# Altium schematic sheet MCU V3.1.SchDoc
size 410 x 182 mm
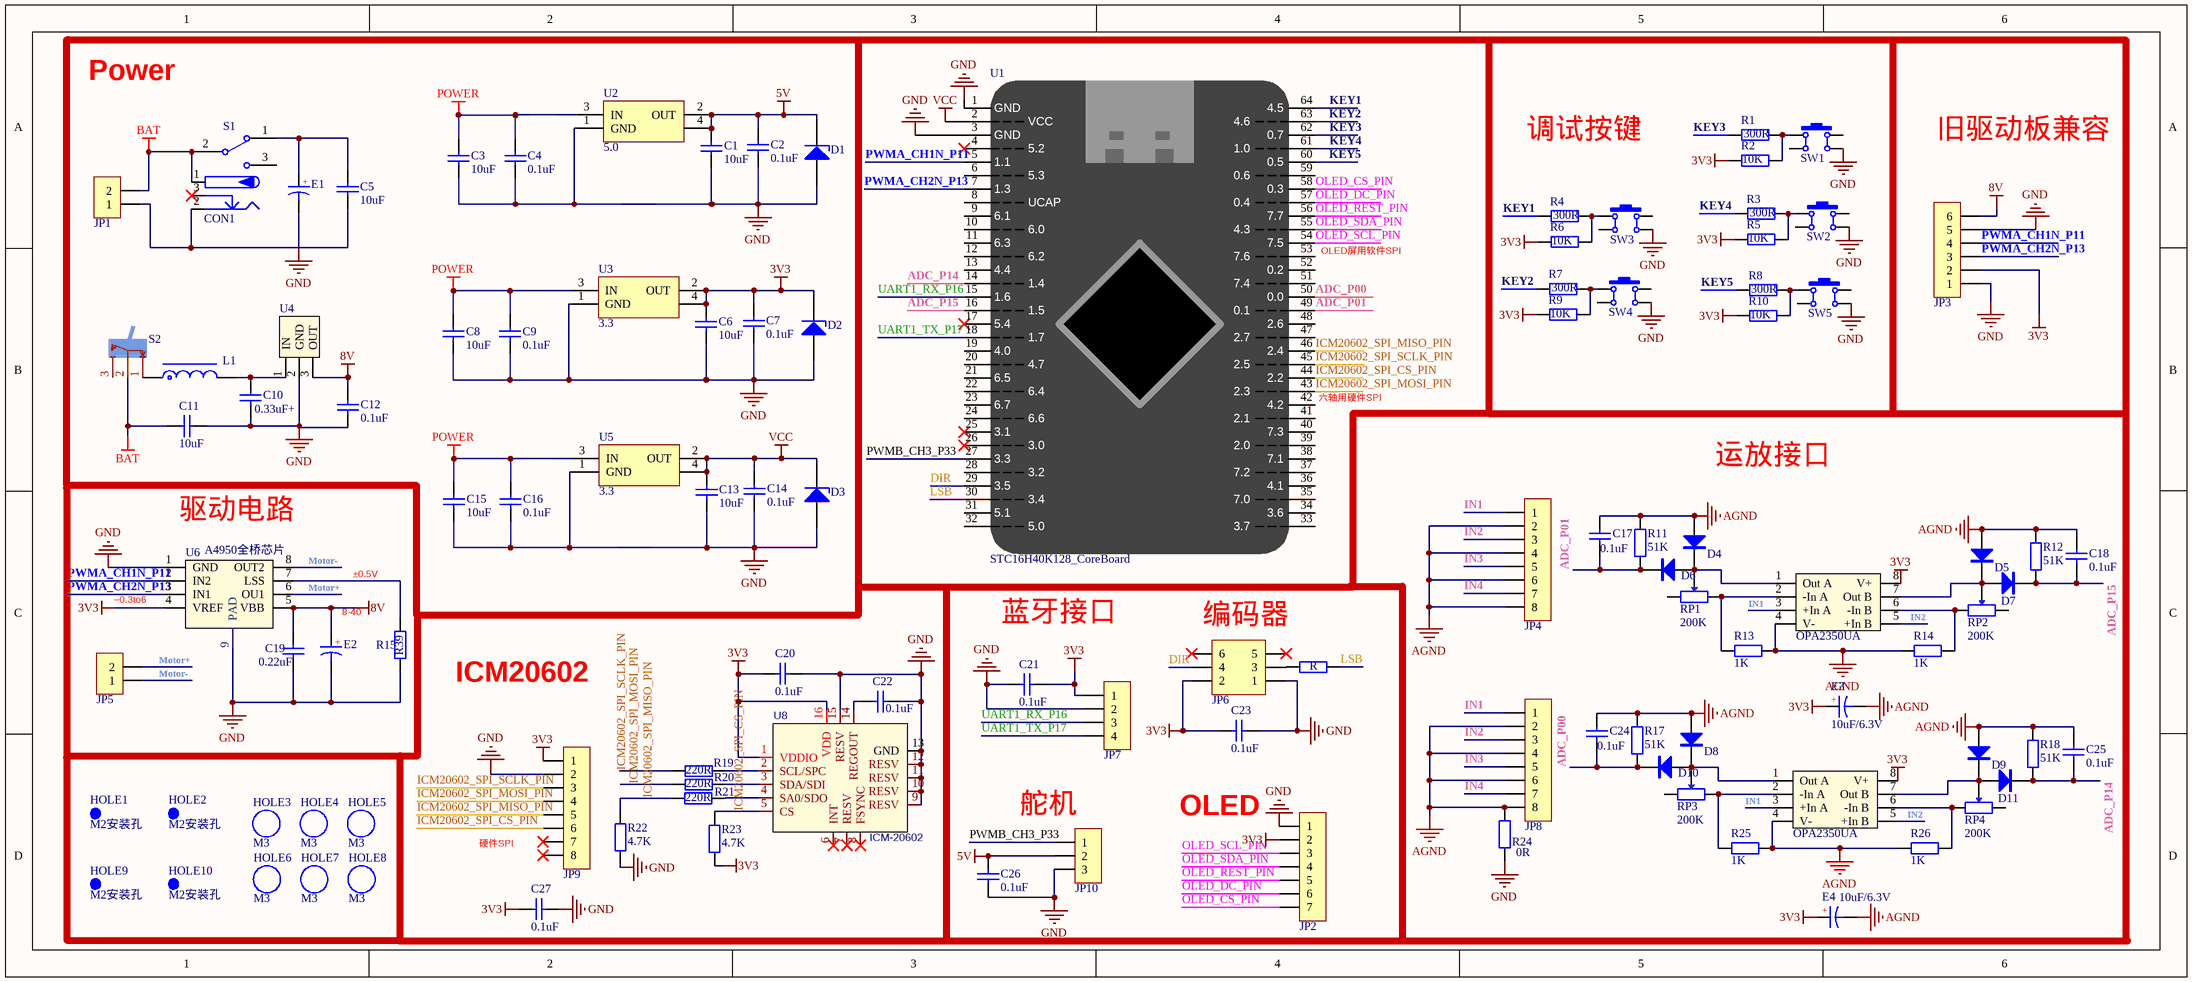
[diagram p0: MCU V3.1.SchDoc]

## Parts
C1  10uF  [C0805_M]
C2  0.1uF  [C0603_M]
C3  10uF  [C0805_M]
C4  0.1uF  [C0603_M]
C5  10uF  [C0805_M]
C6  10uF  [C0805_M]
C7  0.1uF  [C0603_M]
C8  10uF  [C0805_M]
C9  0.1uF  [C0603_M]
C10  0.33uF+  [C0603_M]
C11  10uF  [C0805_M]
C12  0.1uF  [C0603_M]
C13  10uF  [C0805_M]
C14  0.1uF  [C0603_M]
C15  10uF  [C0805_M]
C16  0.1uF  [C0603_M]
C17  0.1uF  [C0603_M]
C18  0.1uF  [C0603_M]
C19  0.22uF  [C0603_M]
C20  0.1uF  [C0603_M]
C21  0.1uF  [C0603_M]
C22  0.1uF  [C0603_M]
C23  0.1uF  [C0603_M]
C24  0.1uF  [C0603_M]
C25  0.1uF  [C0603_M]
C26  0.1uF  [C0603_M]
C27  0.1uF  [C0603_M]
CON1  3.5*1.3  [DC-005]  (value not drawn)
D1  稳压二极管  [稳压二极管 LL-34_L3.5-W1.5-RD]  (value not drawn)
D2  稳压二极管  [稳压二极管 LL-34_L3.5-W1.5-RD]  (value not drawn)
D3  稳压二极管  [稳压二极管 LL-34_L3.5-W1.5-RD]  (value not drawn)
D4  1N5819W  [SOD-123]  (value not drawn)
D5  1N5819W  [SOD-123]  (value not drawn)
D6  1N5819W  [SOD-123]  (value not drawn)
D7  1N5819W  [SOD-123]  (value not drawn)
D8  1N5819W  [SOD-123]  (value not drawn)
D9  1N5819W  [SOD-123]  (value not drawn)
D10  1N5819W  [SOD-123]  (value not drawn)
D11  1N5819W  [SOD-123]  (value not drawn)
E1  100uF/16V  [CT 2.0*5*8 - R]  (value not drawn)
E2  100uF/16V  [CS 6*6 - B]  (value not drawn)
E3  10uF/6.3V  [C_3216]
E4  10uF/6.3V  [C_3216]
HOLE1  M2安装孔  [M2安装孔]
HOLE2  M2安装孔  [M2安装孔]
HOLE3  M3  [M3 125X200]
HOLE4  M3  [M3 125X200]
HOLE5  M3  [M3 125X200]
HOLE6  M3  [M3 125X200]
HOLE7  M3  [M3 125X200]
HOLE8  M3  [M3 125X200]
HOLE9  M2安装孔  [M2安装孔]
HOLE10  M2安装孔  [M2安装孔]
JP1  HDR-1X2  [XH2.54-LI-2P]  (value not drawn)
JP2  HDR-1X7  [HDR2.54-M-LI-7P]  (value not drawn)
JP3  HDR-1X6  [XH2.54-LI-6P]  (value not drawn)
JP4  FPC1.0-8P  [FPC0.5 2H-WS-8P]  (value not drawn)
JP5  HDR-1X2  [XH2.54-LI-2P]  (value not drawn)
JP6  Header3X2  [IDC2.54-LI-2x3P]  (value not drawn)
JP7  HDR-1X4  [HDR2.54-M-LI-4P]  (value not drawn)
JP8  ICM-20602  [HDR2.54-LI-8P]  (value not drawn)
JP9  ICM-20602  [HDR2.54-8P]  (value not drawn)
JP10  HDR-1X3  [HDR2.54-LI-3P]  (value not drawn)
L1  10uH  [CDRH74]  (value not drawn)
R1  300R  [R0603_M]
R2  10K  [R0603_M]
R3  300R  [R0603_M]
R4  300R  [R0603_M]
R5  10K  [R0603_M]
R6  10K  [R0603_M]
R7  300R  [R0603_M]
R8  300R  [R0603_M]
R9  10K  [R0603_M]
R10  10K  [R0603_M]
R11  51K  [R0805_L]
R12  51K  [R0805_L]
R13  1K  [R0805_L]
R14  1K  [R0805_L]
R15  R39  [R0603_M]
R16  R  [R0603_M]
R17  51K  [R0805_L]
R18  51K  [R0805_L]
R19  220R  [R0603_M]
R20  220R  [R0603_M]
R21  220R  [R0603_M]
R22  4.7K  [R0603_M]
R23  4.7K  [R0603_M]
R24  0R  [R0805_M]
R25  1K  [R0805_L]
R26  1K  [R0805_L]
RP1  200K  [3266Y]
RP2  200K  [3266Y]
RP3  200K  [3266Y]
RP4  200K  [3266Y]
S1  SS-12F23  [拨动开关 大电流 SS-12D10]  (value not drawn)
S2  3脚2档小摇臂开关  [3脚3档小摇臂开关]  (value not drawn)
SW1  P5.0  [SW-SMD_4P-L4.2-W3.3-P2.15-LS5.1]  (value not drawn)
SW2  P5.0  [SW-SMD_4P-L4.2-W3.3-P2.15-LS5.1]  (value not drawn)
SW3  P5.0  [SW-SMD_4P-L4.2-W3.3-P2.15-LS5.1]  (value not drawn)
SW4  P5.0  [SW-SMD_4P-L4.2-W3.3-P2.15-LS5.1]  (value not drawn)
SW5  P5.0  [SW-SMD_4P-L4.2-W3.3-P2.15-LS5.1]  (value not drawn)
U1  STC16H40K128_CoreBoard  [STC16H40K128_CoreBoard]
U2  5.0  [SOT223]
U3  3.3  [SOT223]
U4  8V稳压输出-1.5A  [TO220B]  (value not drawn)
U5  3.3  [SOT223]
U6  A4950全桥芯片  [SOIC-8_EP]
U7  OPA2350UA  [SOIC-8_150mil]
U8  ICM-20602  [LGA-16_L3.0-W3.0-P0.50-BL]
U9  OPA2350UA  [SOIC-8_150mil]

## Blocks framed on the sheet
Power: C1-C16 CON1 D1-D3 E1 JP1 L1 S1 S2 U2-U5

## Nets
3V3: C6.2 C7.2 C20.2 C21.1 C23.2 C27.2 D2.2(K) E3.1(A) E4.1(A) JP2.2 JP3.2 JP6.2 JP7.1 JP9.1 R2.2 R5.2 R6.2 R9.2 R10.2 R23.2 U3.2(OUT) U3.4 U6.4(VREF) U7.8(V+) U8.1(VDDIO) U8.16(VDD) U9.8(V+)
5V: C1.2 C2.2 C26.1 D1.2(K) JP10.2 U2.2(OUT) U2.4
8V: C12.1 C19.1 E2.1 JP3.6 U4.3(OUT) U6.5(VBB)
AGND: C17.2 C18.2 C24.2 C25.2 D4.1(A) D5.1(A) D8.1(A) D9.1(A) E3.2(K) E4.2(K) JP4.2 JP4.4 JP4.6 JP4.8 JP8.2 JP8.4 JP8.6 JP8.8 R11.1 R12.1 R13.2 R14.2 R17.1 R18.1 R24.2 R25.2 R26.2 U7.4(V-) U9.4(V-)
BAT: C11.2 CON1.1 JP1.2 S1.2 S2.2
GND: C1.1 C2.1 C3.1 C4.1 C5.1 C6.1 C7.1 C8.1 C9.1 C10.2 C11.1 C12.2 C13.1 C14.1 C15.1 C16.1 C19.2 C20.1 C21.2 C22.2 C23.1 C26.2 C27.1 CON1.2 D1.1(A) D2.1(A) D3.1(A) E1.2 E2.2 JP1.1 JP2.1 JP3.1 JP3.5 JP6.1 JP7.2 JP9.2 JP10.3 R15.1 R22.2 R24.1 SW1.3 SW2.3 SW3.3 SW4.3 SW5.3 U1.1(GND) U1.3(GND) U2.1(GND) U3.1(GND) U4.2(GND) U5.1(GND) U6.1(GND) U6.9(PAD) U8.9(RESV) U8.10(RESV) U8.11(RESV) U8.12(RESV) U8.13(GND) U8.15(RESV)
POWER: C3.2 C4.2 C8.2 C9.2 C15.2 C16.2 U2.3(IN) U3.3(IN) U5.3(IN)
VCC: C13.2 C14.2 D3.2(K) U1.2(VCC) U5.2(OUT) U5.4
ADC_P00: C24.1 D10.2(K) R17.2 U1.50(0.0)
ADC_P01: C17.1 D6.2(K) R11.2 U1.49(0.1)
ADC_P14: C25.1 D11.2(K) R18.2 U1.14(1.4)
ADC_P15: C18.1 D7.2(K) R12.2 U1.16(1.5)
DIR: JP6.4 U1.29(3.5)
ICM20602_SPI_CS_PIN: JP9.6 R23.1 U1.44(2.2) U8.5(CS)
ICM20602_SPI_MISO_PIN: JP9.5 R21.2 R22.1 U1.46(2.4)
ICM20602_SPI_MOSI_PIN: JP9.4 R20.2 U1.43(2.3)
ICM20602_SPI_SCLK_PIN: JP9.3 R19.2 U1.45(2.5)
IN1: JP4.1 JP8.1 U7.3(+In_A) U9.3(+In_A)
IN2: JP4.3 JP8.3 U7.5(+In_B) U9.5(+In_B)
IN3: JP4.5 JP8.5
IN4: JP4.7 JP8.7
KEY1: R4.1 U1.64(4.5)
KEY2: R7.1 U1.63(4.6)
KEY3: R1.1 U1.62(0.7)
KEY4: R3.1 U1.61(1.0)
KEY5: R8.1 U1.60(0.5)
LSB: R16.1 U1.30(3.4)
Motor+: JP5.2 U6.6(OU1)
Motor-: JP5.1 U6.8(OUT2)
OLED_CS_PIN: JP2.7 U1.58(0.3)
OLED_DC_PIN: JP2.6 U1.57(0.4)
OLED_REST_PIN: JP2.5 U1.56(7.7)
OLED_SCL_PIN: JP2.3 U1.54(7.5)
OLED_SDA_PIN: JP2.4 U1.55(4.3)
PWMA_CH1N_P11: JP3.4 U1.5(1.1) U6.2(IN2)
PWMA_CH2N_P13: JP3.3 U1.7(1.3) U6.3(IN1)
PWMB_CH3_P33: JP10.1 U1.27(3.3)
UART1_RX_P16: JP7.3 U1.15(1.6)
UART1_TX_P17: JP7.4 U1.18(1.7)
NetC5_2: C5.2 E1.1 S1.1
NetC10_1: C10.1 L1.2 U4.1(IN)
NetC22_1: C22.1 U8.14(REGOUT)
NetD4_2: D4.2(K) D6.1(A) RP1.2 U7.1(Out_A)
NetD5_2: D5.2(K) D7.1(A) RP2.2 U7.7(Out_B)
NetD8_2: D8.2(K) D10.1(A) RP3.2 U9.1(Out_A)
NetD9_2: D9.2(K) D11.1(A) RP4.2 U9.7(Out_B)
NetJP6_3: JP6.3 R16.2
NetL1_1: L1.1 S2.1
NetR1_2: R1.2 R2.1 SW1.1
NetR3_2: R3.2 R5.1 SW2.1
NetR4_2: R4.2 R6.1 SW3.1
NetR7_2: R7.2 R9.1 SW4.1
NetR8_2: R8.2 R10.1 SW5.1
NetR13_1: R13.1 RP1.3 U7.2(-In_A)
NetR14_1: R14.1 RP2.3 U7.6(-In_B)
NetR15_2: R15.2 U6.7(LSS)
NetR19_1: R19.1 U8.2(SCL/SPC)
NetR20_1: R20.1 U8.3(SDA/SDI)
NetR21_1: R21.1 U8.4(SA0/SDO)
NetR25_1: R25.1 RP3.3 U9.2(-In_A)
NetR26_1: R26.1 RP4.3 U9.6(-In_B)

Not connected (* = marked no-connect by the designer): CON1 3*; JP6 5* 6*; JP9 7* 8*; RP1 1; RP2 1; RP3 1; RP4 1; S1 3; S2 3; SW1 2 4; SW2 2 4; SW3 2 4; SW4 2 4; SW5 2 4; U1 4(5.2)* 6(5.3) 8(UCAP) 9(6.1) 10(6.0) 11(6.3) 12(6.2) 13(4.4) 17(5.4)* 19(4.0) 20(4.7) 21(6.5) 22(6.4) 23(6.7) 24(6.6) 25(3.1)* 26(3.0)* 28(3.2) 31(5.1) 32(5.0) 33(3.7) 34(3.6) 35(7.0) 36(4.1) 37(7.2) 38(7.1) 39(2.0) 40(7.3) 41(2.1) 42(4.2) 47(2.7) 48(2.6) 51(7.4) 52(0.2) 53(7.6) 59(0.6); U8 6(INT)* 7(RESV)* 8(FSYNC)*

## Notes on the sheet
- 调试按键
- 旧驱动板兼容
- (near U1) OLED屏用软件SPI
- (near U1) 六轴用硬件SPI
- (near U6) 驱动电路
- 运放接口
- ±0.5V
- (near U6) –0.3to6
- 8-40
- 蓝牙接口
- (near JP6) 编码器
- ICM20602
- 硬件SPI
- (near JP10) 舵机
- OLED
- (in symbol CS_SMD) +
- (in symbol CT) +

## Library data of the parts
C1-C27 = C: 贴片电容; BOM名称: 无极性贴片电容; 联系卖家，免费查找封装: 唯一出售店铺网址https://shop463601444.taobao.com; 封装库来自淘宝卖家ID：黄晶宝石: 其他店铺购入均为盗版假冒封装库，请立即申请退款
CON1 = P-DC: DC_005电源接口 5.5-2.1; BOM名称: DC电源接口; 联系卖家，免费技术支持: 唯一出售店铺网址https://shop463601444.taobao.com
D1-D3 = 稳压二极管: Zener Diode; 联系卖家，免费查找封装: 唯一出售店铺网址https://shop463601444.taobao.com
D4-D11 = 1N5822: 肖特基二极管; 联系卖家，免费查找封装: 唯一出售店铺网址https://shop463601444.taobao.com; BOM名称: 肖特基二极管
E1 E2 = CS_SMD: 贴片固态电容; 联系卖家，免费查找封装: 唯一出售店铺网址https://shop463601444.taobao.com; 封装库来自淘宝卖家ID：黄晶宝石: 其他店铺购入均为盗版假冒封装库，请立即申请退款; BOM名称: 贴片固态电容
E3 E4 = CT: 贴片钽电容; 联系卖家，免费查找封装: 唯一出售店铺网址https://shop463601444.taobao.com; 封装库来自淘宝卖家ID：黄晶宝石: 其他店铺购入均为盗版假冒封装库，请立即申请退款; BOM名称: 贴片钽电容
HOLE3-HOLE8 = M3: 铜柱孔; 版权归属: 源创客; BOM名称: 铜柱孔; 学习资源: www.ooocke.com
JP1 JP5 = Header 2: 2P接插件; 版权归属: 源创客; BOM名称: 2P接插件; 学习资源: www.ooocke.com
JP2 = Header 7: 7P接插件; 封装库来自淘宝卖家 ID：黄晶宝石: 其他店铺购入均为盗版假冒封装库; 联系卖家，免费查找封装: 唯一出售店铺网址https://shop463601444.taobao.com; BOM名称: 7P接插件
JP3 = Header 6: 6P接插件; 封装库来自淘宝卖家 ID：黄晶宝石: 其他店铺购入均为盗版假冒封装库; 联系卖家，免费查找封装: 唯一出售店铺网址https://shop463601444.taobao.com; BOM名称: 6P接插件
JP4 = FPC-8P: FPC连接器; 版权归属: 源创客; BOM名称: FPC连接器; 学习资源: www.ooocke.com
JP6 = Header 3X2: 3*2P接插件; 封装库来自淘宝卖家 ID：黄晶宝石: 其他店铺购入均为盗版假冒封装库; 联系卖家，免费查找封装: 唯一出售店铺网址https://shop463601444.taobao.com; BOM名称: 3*2P接插件
JP7 = Header 4: 4P接插件; 封装库来自淘宝卖家 ID：黄晶宝石: 其他店铺购入均为盗版假冒封装库; 联系卖家，免费查找封装: 唯一出售店铺网址https://shop463601444.taobao.com; BOM名称: 4P接插件
JP8 JP9 = Header 8: 8P接插件; 封装库来自淘宝卖家 ID：黄晶宝石: 其他店铺购入均为盗版假冒封装库; 联系卖家，免费查找封装: 唯一出售店铺网址https://shop463601444.taobao.com; BOM名称: 8P接插件
JP10 = Header 3: 3P接插件; 封装库来自淘宝卖家 ID：黄晶宝石: 其他店铺购入均为盗版假冒封装库; 联系卖家，免费查找封装: 唯一出售店铺网址https://shop463601444.taobao.com; BOM名称: 3P接插件
L1 = L-CDRH: CDRH功率屏蔽电感; BOM名称: 功率屏蔽电感; 联系卖家，免费查找封装: 唯一出售店铺网址https://shop463601444.taobao.com; 封装库来自淘宝卖家ID：黄晶宝石: 其他店铺购入均为盗版假冒封装库，请立即申请退款
R1-R26 = R: 贴片电阻; 联系卖家，免费查找封装: 唯一出售店铺网址https://shop463601444.taobao.com; 封装库来自淘宝卖家ID：黄晶宝石: 其他店铺购入均为盗版假冒封装库，请立即申请退款; BOM名称: 贴片电阻
RP1-RP4 = RP: 单联电位器; BOM名称: 插件电位器; 联系卖家，免费查找封装: 唯一出售店铺网址https://shop463601444.taobao.com; 封装库来自淘宝卖家ID：黄晶宝石: 其他店铺购入均为盗版假冒封装库，请立即申请退款
S1 = SSW-1P: 1路波动开关; BOM名称: 波动开关; 版权归属: 源创客; 学习资源: www.ooocke.com
SW1-SW5 = SW-PB4: 4脚微动开关; BOM名称: 直插6x6轻触开关; 联系卖家，免费查找封装: 唯一出售店铺网址https://shop463601444.taobao.com
U1 = STC16H40K128_CoreBoard: 逐飞科技 STC16H40K128核心板
U2 U3 U5 = AS1117-3.3: 800mA and 1A Low Dropout Positive Regulator 2.85V, 3.3V, 5V, and Adjustable; Published: 8-Jun-2000; LatestRevisionDate: 17-Jul-2002; LatestRevisionNote: Re-released for DXP Platform.; DatasheetVersion: Sep-1997; PackageVersion: revC; PackageReference: ZZ311; Publisher: Altium Limited; PackageDescription: SOT-223/SC-73; 4 Leads; Body 6.7 x 7.3 mm, inc. leads (LxW max); ComponentLink1Description: Manufacturer Link; ComponentLink1URL: http://www.ti.com/; ComponentLink2Description: Datasheet; ComponentLink2URL: http://www-s.ti.com/sc/ds/REG1117.pdf
U4 = L7808CV线性稳压器8V
U6 = A4950全桥芯片: TI全桥芯片 SOIC-8
U8 = ICM-20602: BOM_Manufacturer: TDK InvenSense; Contributor: LCSC; BOM_Paste Type: expand; BOM_Assembly Type: smtWeld; BOM_Supplier: LCSC; BOM_Supplier Part: C97633; BOM_Manufacturer Part: ICM-20602; spicePre: U; spiceSymbolName: ICM-20602